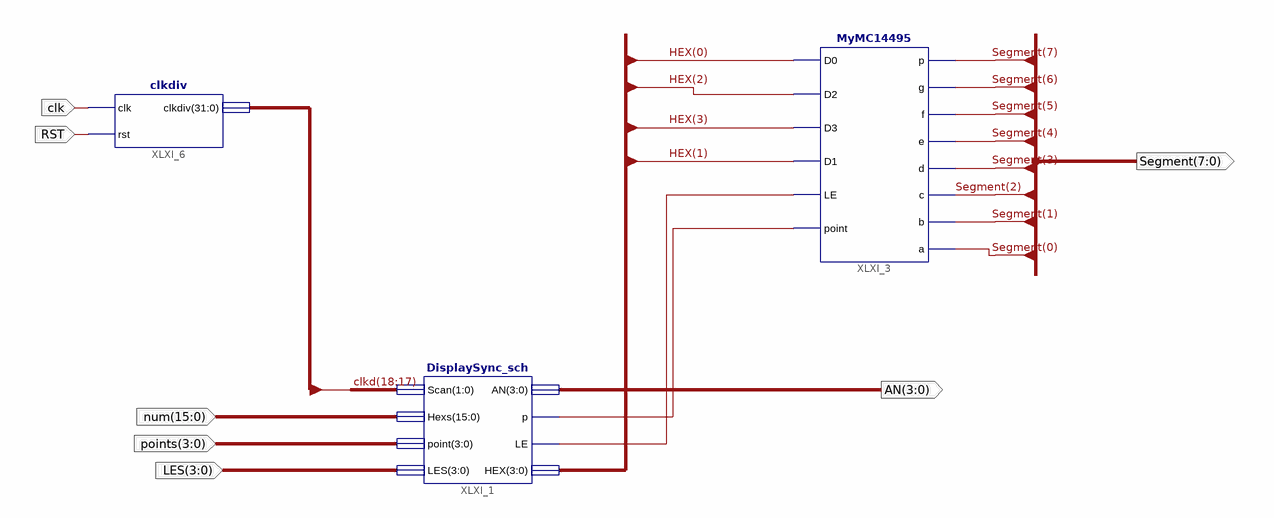
[diagram p0: schematic sheet 1]
// Xilinx ISE schematic DispNum_sch.sch (kintex7) as structural Verilog: 3 symbols, 7 ports
module DispNum_sch (
  input  clk,
  input  RST,
  input  [15:0] num,
  input  [3:0] points,
  input  [3:0] LES,
  output [3:0] AN,
  output [7:0] Segment
);

  wire XLXN_10, XLXN_11;
  wire [3:0] HEX;
  wire [31:0] clkd;

  DisplaySync_sch XLXI_1 (
    .Scan(clkd[18:17]), .Hexs(num), .point(points), .LES(LES), .AN(AN), .p(XLXN_10), .LE(XLXN_11), .HEX(HEX));
  MyMC14495 XLXI_3 (
    .D0(HEX[0]), .D2(HEX[2]), .D3(HEX[3]), .D1(HEX[1]), .LE(XLXN_11), .point(XLXN_10), .p(Segment[7]),
    .g(Segment[6]), .f(Segment[5]), .e(Segment[4]), .d(Segment[3]), .c(Segment[2]), .b(Segment[1]),
    .a(Segment[0]));
  clkdiv XLXI_6 (.clk(clk), .rst(RST), .clkdiv(clkd));
endmodule
